# EAGLE design Zio Qwiic to Grove Adapter (EAGLE 9.2.2)
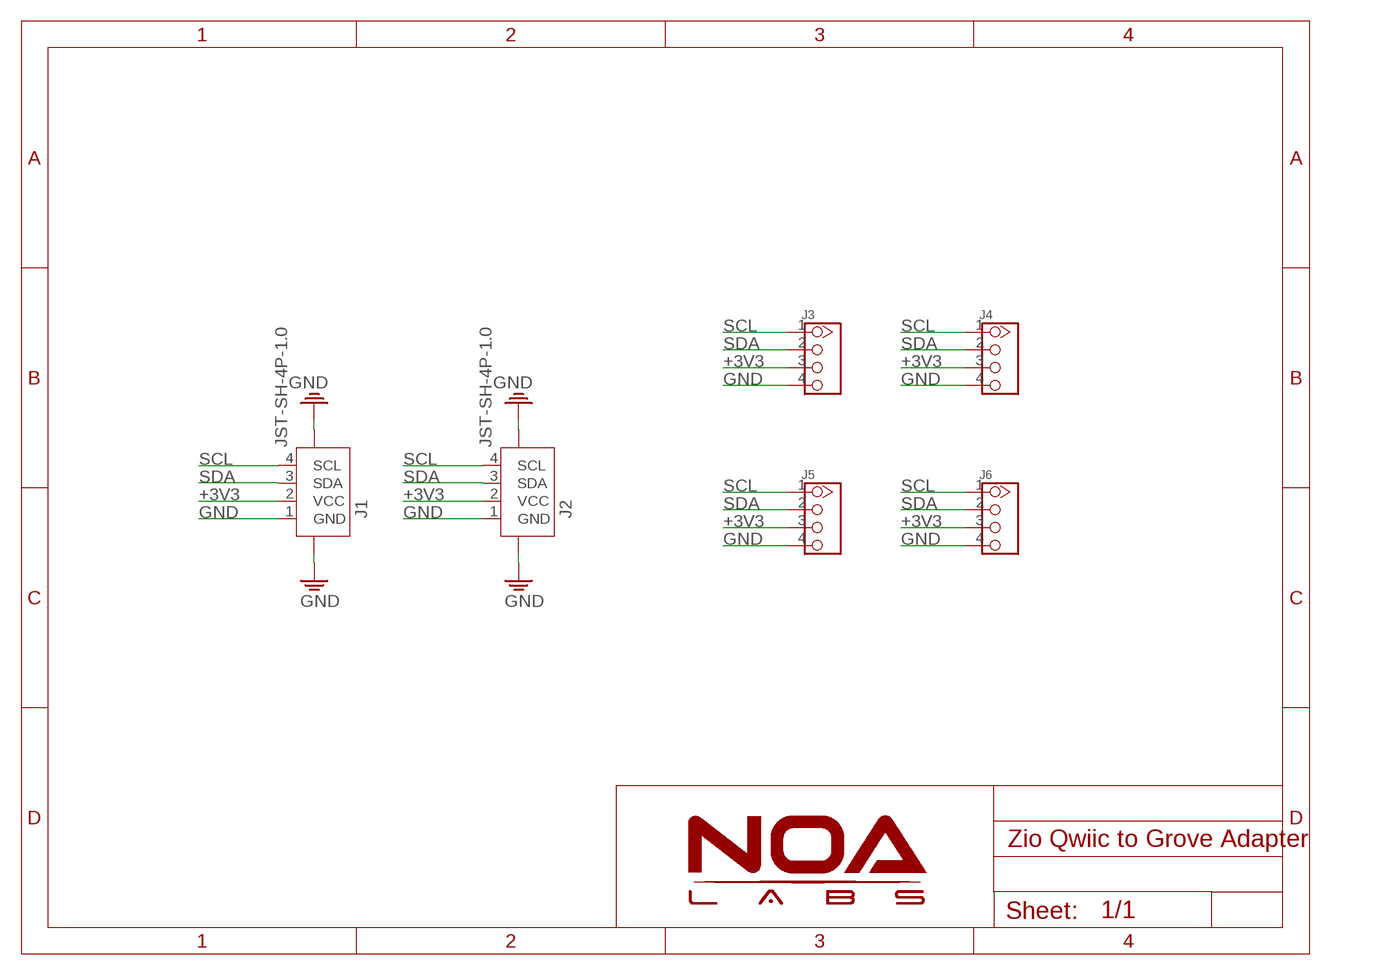
[diagram p0: schematic, sheet 1]

## Parts
J1  JST-SH-4P-1.0  [JST-SH-4P]
J2  JST-SH-4P-1.0  [JST-SH-4P]
J3  TWIG-4P-2.0-2.0  [4P-2.0]
J4  TWIG-4P-2.0-2.0  [4P-2.0]
J5  TWIG-4P-2.0-2.0  [4P-2.0]
J6  TWIG-4P-2.0-2.0  [4P-2.0]

## Nets
+3V3: J1.2(VCC) J2.2(VCC) J3.3 J4.3 J5.3 J6.3
GND: J1.1(GND) J1.NC1 J1.NC2 J2.1(GND) J2.NC1 J2.NC2 J3.4 J4.4 J5.4 J6.4
SCL: J1.4(SCL) J2.4(SCL) J3.1 J4.1 J5.1 J6.1
SDA: J1.3(SDA) J2.3(SDA) J3.2 J4.2 J5.2 J6.2

## Library data of the parts
J1 J2 = Connector:JST-SH-4P
J3-J6 = Connector:TWIG-4P-2.0

## Board
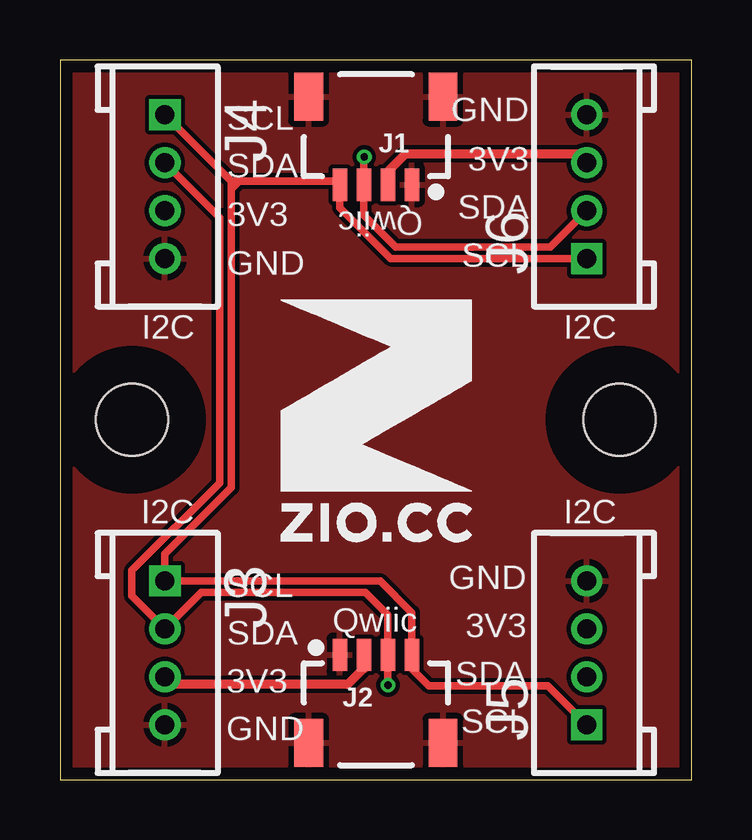
[diagram p1: board, top side]
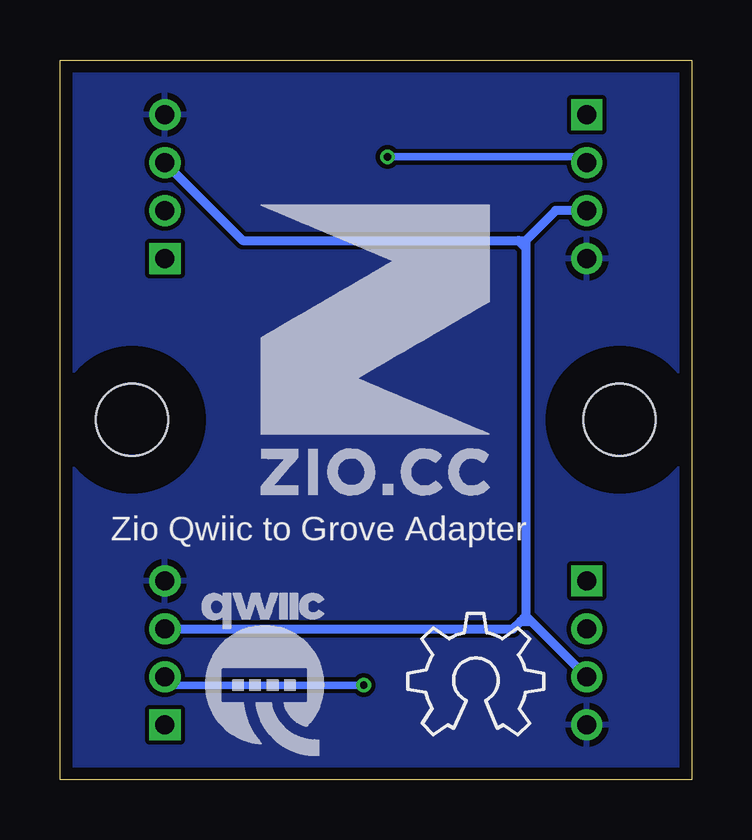
[diagram p2: board, bottom side, seen from below]

Size 26.32 x 30 mm. Coordinates in mm from the lower left corner, seen from the top.
Outline: 0,0 26.32,0 26.32,30 0,30 0,0
Copper layers (1*16): Top 0.035mm / dielectric 1.5mm / Bottom 0.035mm
Design rules "NOA Eagle Rule": minimum track width 7mil, minimum drill 12mil, track to track 7mil, track to pad 7mil, pad to pad 7mil, via to via 7mil, smd to smd 0mil, copper to edge 20mil, drill to drill 10mil, minimum pad ring 10mil, minimum via ring 6mil, stop-mask expansion 2mil, vias tented up to drill 25mil, thermal gap 10mil
Holes 3 mm at 3,15 23.32,15
tRestrict: area 0,12 to 6,18; area 20.3,12 to 26.3,18
bRestrict: area 0,12 to 6,18; area 20.3,12 to 26.3,18

### Footprints (pad centres in the part's own frame; a part is rotated, then mirrored left to right if it is on the bottom)
JST-SH-4P = smd 0.6 x 1.35: 1 1.5,0; 2 0.5,0; 3 -0.5,0; 4 -1.5,0 | smd 1.2 x 2: NC1 -2.8,3.675; NC2 2.8,3.675
4P-2.0 = drill 0.8 pad 1.27 square: 1 -3,0 | drill 0.8 pad 1.27: 2 -1,0; 3 1,0; 4 3,0

### Placement (x,y rotation side)
J1  13.16,24.8 0 top
J2  13.16,5.2 180 top
J3  4.37,5.28 270 top
J4  4.37,24.72 270 top
J5  21.95,5.28 90 top
J6  21.95,24.72 90 top
U$1  [10MM]  9.19,9.93 0 top
U$2  [12MM]  18.06,11.79 0 bottom
U$3  [QWIIC-LOGO-MEDIUM]  17.86,4.45 0 bottom
U$4  [OSHW_6X200_NOTEXT]  11.84,1.85 0 bottom

### Tracks (layer width: path | path; a pad name or v marks a point on that pad's centre or on a via)
+3V3
  Top 0.381: J1.2 13.66,25.34 14.4,26.09 21.58,26.09 J6.3 | J2.2 12.66,4.63 11.99,3.96 4.69,3.96 J3.3
  Bottom 0.381: J4.3 5.67,23.72 6.91,22.48 | 6.91,22.48 6.91,22.15 | 6.91,22.15 6.91,6.82 | 6.91,6.82 6.69,6.6 | 6.69,6.6 J3.3 | J5.3 7.45,6.28 7.13,6.6 | 7.13,6.6 6.91,6.82 | 7.13,6.6 6.69,6.6 | J6.3 18.71,22.48 7.21,22.48 | 7.21,22.48 6.91,22.48 | 6.91,22.15 7.21,22.45 7.21,22.48
GND
  pour Bottom: 0,30 26.31,30 26.31,0 0,0
  pour Top: 0,30 26.31,30 26.31,0 0,0
SCL
  Top 0.305: J5.1 20.32,3.91 15.37,3.91 14.66,4.62 J2.4 14.66,6.96 13.34,8.28 J3.1 4.37,9.4 7.14,12.17 7.14,24.61 | J6.1 13.79,21.72 11.66,23.85 J1.4 11.66,24.94 7.47,24.94 | 7.47,24.94 7.15,24.94 7.14,24.95 | 7.14,24.95 J4.1 | 7.14,24.95 7.14,24.61 | 7.47,24.94 7.14,24.61
SDA  (via drill 0.3)
  Top 0.305: v13.66,3.94 J2.3 13.66,6.86 12.73,7.8 5.89,7.8 J3.2 3,7.65 3,8.71 6.66,12.37 6.66,23.43 J4.2 | J6.2 20.43,22.2 13.99,22.2 12.66,23.53 J1.3 12.66,25.94 v12.68,25.96
  Bottom 0.305: v13.66,3.94 21.61,3.94 J5.2 | v12.68,25.96 4.61,25.96 J4.2

### Text on the board
tPlace: GND | SCL | 3V3 | SDA | Qwiic | SDA | 3V3 | SCL | GND | I2C | I2C | I2C | I2C | GND | SCL | 3V3 | SDA | Qwiic | SDA | 3V3 | SCL | GND
bPlace: Zio Qwiic to Grove Adapter